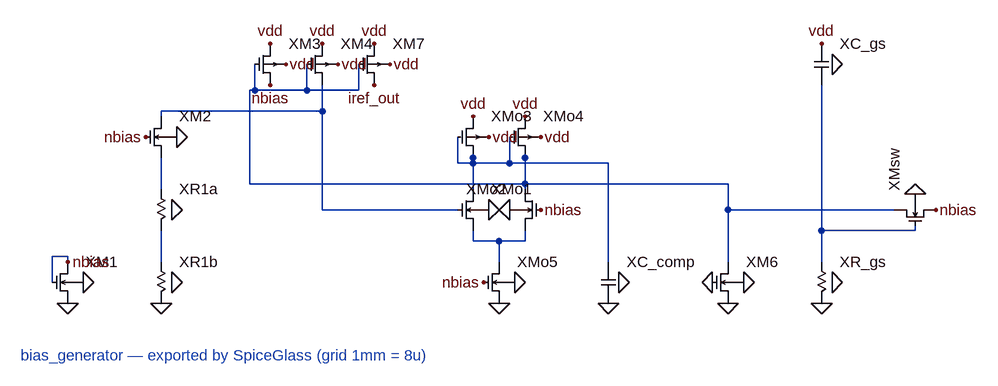
[diagram p0: schematic bias_generator.asc]
bias_generator.asc, the LTspice schematic file:
Version 4
SHEET 1 1640 552
WIRE 112 456 112 416
WIRE 112 416 136 416
WIRE 136 416 136 424
WIRE 424 120 424 160
WIRE 504 120 504 160
WIRE 584 120 584 160
WIRE 424 160 584 160
WIRE 760 376 760 392
WIRE 840 376 840 392
WIRE 800 392 800 424
WIRE 760 392 840 392
WIRE 760 264 760 312
WIRE 840 264 840 312
WIRE 736 232 736 272
WIRE 816 232 816 272
WIRE 736 272 816 272
WIRE 760 272 760 264
WIRE 280 424 280 376
WIRE 280 312 280 264
WIRE 968 424 968 272
WIRE 968 272 760 272
WIRE 1296 424 1296 152
WIRE 1440 368 1440 376
WIRE 1440 376 1296 376
WIRE 528 152 528 192
WIRE 528 192 280 192
WIRE 280 192 280 200
WIRE 736 344 528 344
WIRE 528 344 528 192
WIRE 840 264 840 304
WIRE 840 304 416 304
WIRE 416 304 416 160
WIRE 416 160 424 160
WIRE 1152 424 1152 304
WIRE 1152 304 840 304
WIRE 1408 344 1152 344
FLAG 448 152 nbias
FLAG 136 424 nbias
FLAG 256 232 nbias
FLAG 864 344 nbias
FLAG 776 456 nbias
FLAG 1472 344 nbias
FLAG 448 88 vdd
FLAG 472 120 vdd
FLAG 528 88 vdd
FLAG 552 120 vdd
FLAG 760 200 vdd
FLAG 784 232 vdd
FLAG 840 200 vdd
FLAG 864 232 vdd
FLAG 608 88 vdd
FLAG 632 120 vdd
FLAG 1296 88 vdd
FLAG 136 488 0
FLAG 160 456 0
FLAG 304 232 0
FLAG 296 344 0
FLAG 280 488 0
FLAG 296 456 0
FLAG 784 344 0
FLAG 816 344 0
FLAG 800 488 0
FLAG 824 456 0
FLAG 968 488 0
FLAG 984 456 0
FLAG 1128 456 0
FLAG 1152 488 0
FLAG 1176 456 0
FLAG 1312 120 0
FLAG 1296 488 0
FLAG 1312 456 0
FLAG 1440 320 0
FLAG 608 152 iref_out
SYMBOL sg_sym\\sg_pmos4 448 120 R0
SYMATTR InstName XM3
SYMATTR Value sky130_fd_pr__pfet_01v8 w=4 l=4
SYMBOL sg_sym\\sg_pmos4 528 120 R0
SYMATTR InstName XM4
SYMATTR Value sky130_fd_pr__pfet_01v8 w=4 l=4
SYMBOL sg_sym\\sg_nmos4 136 456 R0
SYMATTR InstName XM1
SYMATTR Value sky130_fd_pr__nfet_01v8 w=2 l=4
SYMBOL sg_sym\\sg_nmos4 280 232 R0
SYMATTR InstName XM2
SYMATTR Value sky130_fd_pr__nfet_01v8 w=8 l=4
SYMBOL sg_sym\\sg_res3 280 344 R0
SYMATTR InstName XR1a
SYMATTR Value sky130_fd_pr__res_xhigh_po w=0.35 l=7.09
SYMBOL sg_sym\\sg_res3 280 456 R0
SYMATTR InstName XR1b
SYMATTR Value sky130_fd_pr__res_iso_pw w=0.35 l=6.56
SYMBOL sg_sym\\sg_nmos4 760 344 R0
SYMATTR InstName XMo1
SYMATTR Value sky130_fd_pr__nfet_01v8 w=1 l=4
SYMBOL sg_sym\\sg_nmos4 840 344 M0
SYMATTR InstName XMo2
SYMATTR Value sky130_fd_pr__nfet_01v8 w=1 l=4
SYMBOL sg_sym\\sg_pmos4 760 232 R0
SYMATTR InstName XMo3
SYMATTR Value sky130_fd_pr__pfet_01v8 w=2 l=4
SYMBOL sg_sym\\sg_pmos4 840 232 R0
SYMATTR InstName XMo4
SYMATTR Value sky130_fd_pr__pfet_01v8 w=2 l=4
SYMBOL sg_sym\\sg_nmos4 800 456 R0
SYMATTR InstName XMo5
SYMATTR Value sky130_fd_pr__nfet_01v8 w=1 l=4
SYMBOL sg_sym\\sg_cap3 968 456 R0
SYMATTR InstName XC_comp
SYMATTR Value sky130_fd_pr__cap_mim_m3_1 w=50 l=50
SYMBOL sg_sym\\sg_pmos4 608 120 R0
SYMATTR InstName XM7
SYMATTR Value sky130_fd_pr__pfet_01v8 w=4 l=4
SYMBOL sg_sym\\sg_nmos4 1152 456 R0
SYMATTR InstName XM6
SYMATTR Value sky130_fd_pr__nfet_01v8 w=0.5 l=0.5
SYMBOL sg_sym\\sg_cap3 1296 120 R0
SYMATTR InstName XC_gs
SYMATTR Value sky130_fd_pr__cap_mim_m3_1 w=25 l=50
SYMBOL sg_sym\\sg_res3 1296 456 R0
SYMATTR InstName XR_gs
SYMATTR Value sky130_fd_pr__res_xhigh_po w=0.35 l=1360
SYMBOL sg_sym\\sg_nmos4 1440 344 R270
SYMATTR InstName XMsw
SYMATTR Value sky130_fd_pr__nfet_01v8 w=4 l=0.5
TEXT 64 568 Left 2 ;bias_generator — exported by SpiceGlass (grid 1mm = 8u)

The netlist it stands for:
* bias_generator.asc
XXM3 nbias N001 vdd vdd sky130_fd_pr__pfet_01v8 w=4 l=4  ; pins d g s b
XXM4 N007 N001 vdd vdd sky130_fd_pr__pfet_01v8 w=4 l=4  ; pins d g s b
XXM1 nbias nbias 0 0 sky130_fd_pr__nfet_01v8 w=2 l=4  ; pins d g s b
XXM2 N007 nbias N005 0 sky130_fd_pr__nfet_01v8 w=8 l=4  ; pins d g s b
XXR1a N005 N004 0 sky130_fd_pr__res_xhigh_po w=0.35 l=7.09  ; pins p n b
XXR1b N004 0 0 sky130_fd_pr__res_iso_pw w=0.35 l=6.56  ; pins p n b
XXMo1 N003 N007 N002 0 sky130_fd_pr__nfet_01v8 w=1 l=4  ; pins d g s b
XXMo2 N001 nbias N002 0 sky130_fd_pr__nfet_01v8 w=1 l=4  ; pins d g s b
XXMo3 N003 N003 vdd vdd sky130_fd_pr__pfet_01v8 w=2 l=4  ; pins d g s b
XXMo4 N001 N003 vdd vdd sky130_fd_pr__pfet_01v8 w=2 l=4  ; pins d g s b
XXMo5 N002 nbias 0 0 sky130_fd_pr__nfet_01v8 w=1 l=4  ; pins d g s b
XXC_comp N003 0 0 sky130_fd_pr__cap_mim_m3_1 w=50 l=50  ; pins p n b
XXM7 iref_out N001 vdd vdd sky130_fd_pr__pfet_01v8 w=4 l=4  ; pins d g s b
XXM6 N001 0 0 0 sky130_fd_pr__nfet_01v8 w=0.5 l=0.5  ; pins d g s b
XXC_gs vdd N006 0 sky130_fd_pr__cap_mim_m3_1 w=25 l=50  ; pins p n b
XXR_gs N006 0 0 sky130_fd_pr__res_xhigh_po w=0.35 l=1360  ; pins p n b
XXMsw N001 N006 nbias 0 sky130_fd_pr__nfet_01v8 w=4 l=0.5  ; pins d g s b
* bias_generator — exported by SpiceGlass (grid 1mm = 8u)
.backanno
.end